# EAGLE schematic OOBDROID_V1 (EAGLE 7.2.0)
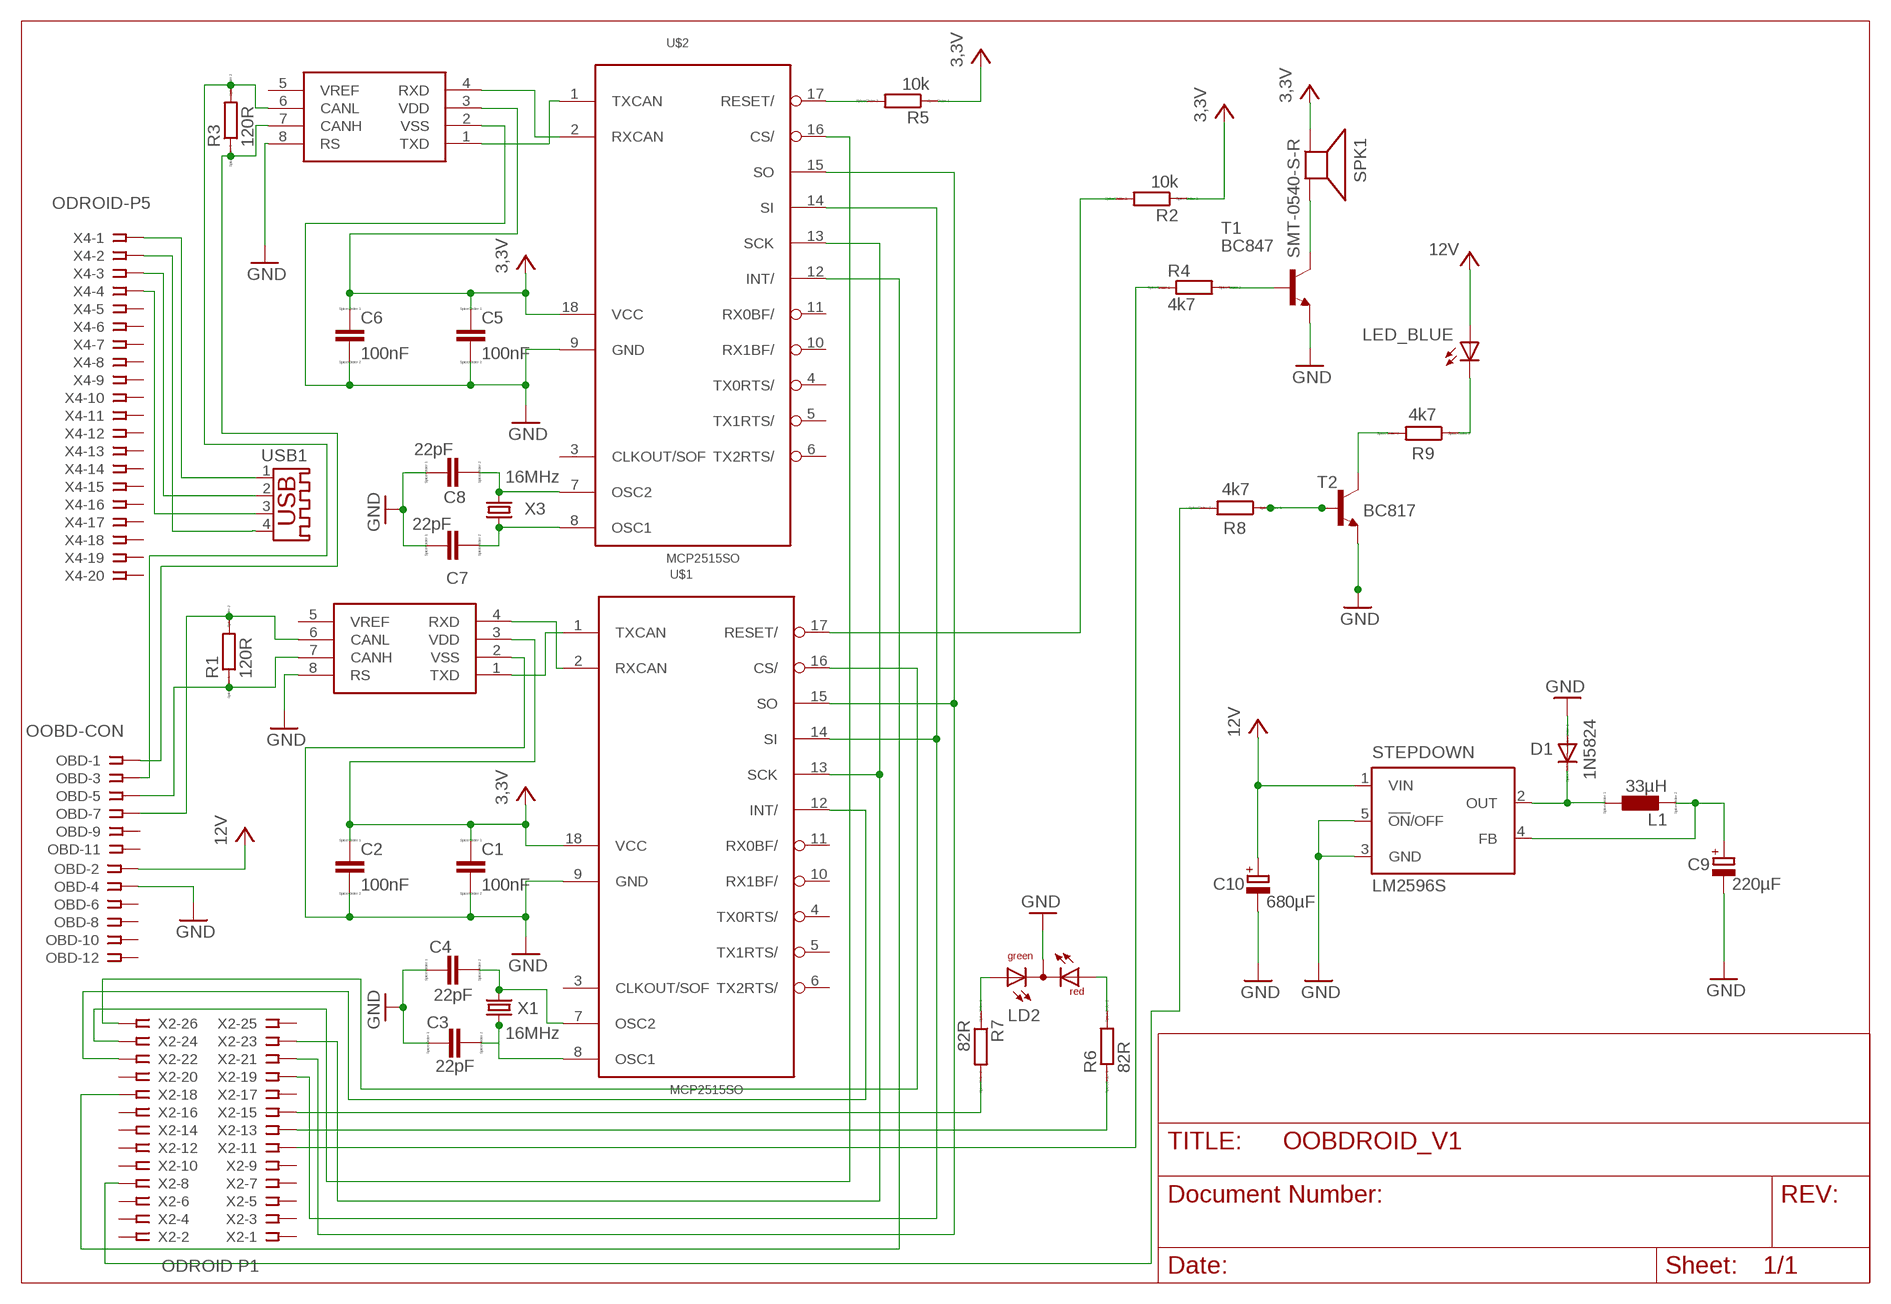
[diagram p0: schematic, sheet 1]

## Parts
C1  100nF  C  [C0805]
C2  100nF  C  [C0805]
C3  22pF  C  [C0805]
C4  22pF  C  [C0805]
C5  100nF  C  [C0805]
C6  100nF  C  [C0805]
C7  22pF  C  [C0805]
C8  22pF  C  [C0805]
C9  220µF  CPOL-EUE1.8-4  [E1,8-4]
C10  680µF  CPOL-EUE1.8-4  [E1,8-4]
D1  1N5824  DIODE-DO214AA  [DO214AA]
L1  33µH  LL4532P  [L4532P]
LD2  DUOLED-RG-C  [DUOLED-C-5MM]
LED_BLUE  LED5MM  [LED5MM]
OBD  OOBD-CON  SSW-106-02-S-D  [SSW-106-02-S-D]
R1  120R  RR0603  [R0603]
R2  10k  RR0603  [R0603]
R3  120R  RR0603  [R0603]
R4  4k7  RR0603  [R0603]
R5  10k  RR0603  [R0603]
R6  82R  RR0603  [R0603]
R7  82R  RR0603  [R0603]
R8  4k7  RR0603  [R0603]
R9  4k7  RR0603  [R0603]
SPK1  SMT-0540-S-R  [SMT-0540-S-R]
STEPDOWN  LM2596S  [TO263-5]
T1  BC847  [SOT23]
T2  BC817  BC847  [SOT23]
U1  MCP2551  [SO08]
U2  MCP2551  [SO08]
U$1  MCP2515SO  [SO18L]
U$2  MCP2515SO  [SO18L]
USB1  USB-A003  [USB-A003]
X1  16MHz  CRYSTALS-NOGND-HC49  [HC49]
X2  ODROID P1  SSW-113-02-S-D  [SSW-113-02-S-D]
X3  16MHz  CRYSTALS-NOGND-HC49  [HC49]
X4  ODROID-P5  SSW-120-02-S-S  [SSW-120-02-S-S]

## Nets
GND: C1.2 C2.2 C3.1 C4.1 C5.2 C6.2 C7.1 C8.1 C9.- C10.- D1.A LD2.C OBD.4 STEPDOWN.3(GND) STEPDOWN.5(!ON!/OFF) T1.2(E) T2.2(E) U1.2(VSS) U1.8(RS) U2.2(VSS) U2.8(RS) U$1.9(GND) U$2.9(GND)
N$1: OBD.5 R1.1 U1.7(CANH)
N$2: D1.C L1.1 STEPDOWN.2(OUT)
N$3: C8.2 U$2.7(OSC2) X3.2
N$4: C9.+ L1.2 STEPDOWN.4(FB)
N$5: C7.2 U$2.8(OSC1) X3.1
N$6: R5.2 U$2.17(RESET/)
N$7: U2.4(RXD) U$2.2(RXCAN)
N$8: U2.1(TXD) U$2.1(TXCAN)
N$9: OBD.3 R3.2 U2.6(CANL)
N$10: OBD.1 R3.1 U2.7(CANH)
N$11: C4.2 U$1.7(OSC2) X1.2
N$12: C3.2 U$1.8(OSC1) X1.1
N$13: R2.2 U$1.17(RESET/)
N$14: U1.4(RXD) U$1.2(RXCAN)
N$15: U1.1(TXD) U$1.1(TXCAN)
N$16: OBD.7 R1.2 U1.6(CANL)
N$18: LED_BLUE.K(C) R9.1
N$19: U$1.16(CS/) X2.26
N$20: SPK1.+(-) T1.3(C)
N$21: R4.2 T1.1(B)
N$22: LD2.AR R6.2
N$23: LD2.AX(AG) R7.1
N$24: R7.2 X2.15
N$25: R6.1 X2.13
N$26: USB1.1 X4.1
N$27: USB1.4 X4.2
N$28: USB1.2 X4.3
N$29: USB1.3 X4.4
N$30: R4.1 X2.11
N$31: U$1.12(INT/) X2.22
N$32: U$2.12(INT/) X2.18
N$33: U$2.16(CS/) X2.24
N$34: R9.2 T2.3(C)
N$35: R8.1 T2.1(B)
N$36: R8.2 X2.8
N$38: U$1.14(SI) U$2.14(SI) X2.19
N$43: U$1.15(SO) U$2.15(SO) X2.21
N$44: U$1.13(SCK) U$2.13(SCK) X2.23
VCC: C1.1 C2.1 C5.1 C6.1 C10.+ LED_BLUE.A OBD.2 R2.1 R5.1 SPK1.-(+) STEPDOWN.1(VIN) U1.3(VDD) U2.3(VDD) U$1.18(VCC) U$2.18(VCC) ; supply symbol labelled 3,3V, 12V
Unconnected: OBD.6 OBD.8 OBD.9 OBD.10 OBD.11 OBD.12 U1.5(VREF) U2.5(VREF) U$1.3(CLKOUT/SOF) U$1.4(TX0RTS/) U$1.5(TX1RTS/) U$1.6(TX2RTS/) U$1.10(RX1BF/) U$1.11(RX0BF/) U$2.3(CLKOUT/SOF) U$2.4(TX0RTS/) U$2.5(TX1RTS/) U$2.6(TX2RTS/) U$2.10(RX1BF/) U$2.11(RX0BF/) X2.1 X2.2 X2.3 X2.4 X2.5 X2.6 X2.7 X2.9 X2.10 X2.12 X2.14 X2.16 X2.17 X2.20 X2.25 X4.5 X4.6 X4.7 X4.8 X4.9 X4.10 X4.11 X4.12 X4.13 X4.14 X4.15 X4.16 X4.17 X4.18 X4.19 X4.20

## Library data of the parts
C1-C8 = eagle-ltspice:C: CAPACITOR, European symbol; SPICEMODEL: NONE; SPICEPREFIX: C
C9 C10 = resistor:CPOL-EU: POLARIZED CAPACITOR, European symbol
D1 = diode:DIODE-: DIODE
L1 = eagle-ltspice:L: INDUCTOR, European symbol; SPICEMODEL: NONE; SPICEPREFIX: L
LD2 = led:DUOLED-RG-C: DUO LED 2 colors (red/green), 5 mm, round, common Cathode www.ligitek.com or other producers.
LED_BLUE = adafruit:LED: LED OSRAM: - CHIPLED LG R971, LG N971, LY N971, LG Q971, LY Q971, LO R971, LY R971 LH N974, LH R974 LS Q976, LO Q976, LY Q976 LO Q996 - Hyper CHIPLED LW Q18S LB Q993, LB Q99A, LB R99A - SideLED LS A670, LO A670, LY A670, LG A670, LP A670 LB A673, LV A673, LT A673, LW A673 LH A674 LY A675 LS A676, LA A676, LO A676, LY A676, LW A676 LS A679, LY A679, LG A679 - Hyper Micro SIDELED® LS Y876, LA Y876, LO Y876, LY Y876 LT Y87S - SmartLED LW L88C, LW L88S LB L89C, LB L89S, LG L890 LS L89K, LO L89K, LY L89K LS L896, LA L896, LO L896, LY L896 - TOPLED LS T670, LO T670, LY T670, LG T670, LP T670 LSG T670, LSP T670, LSY T670, LOP T670, LYG T670 LG T671, LOG T671, LSG T671 LB T673, LV T673, LT T673, LW T673 LH T674 LS T676, LA T676, LO T676, LY T676, LB T676, LH T676, LSB T676, LW T676 LB T67C, LV T67C, LT T67C, LS T67K, LO T67K, LY T67K, LW E67C LS E67B, LA E67B, LO E67B, LY E67B, LB E67C, LV E67C, LT E67C LW T67C LS T679, LY T679, LG T679 LS T770, LO T770, LY T770, LG T770, LP T770 LB T773, LV T773, LT T773, LW T773 LH T774 LS E675, LA E675, LY E675, LS T675 LS T776, LA T776, LO T776, LY T776, LB T776 LHGB T686 LT T68C, LB T68C - Hyper Mini TOPLED® LB M676 - Mini TOPLED Santana® LG M470 LS M47K, LO M47K, LY M47K Source: http://www.osram.convergy.de/
OBD = con-samtec:SSW-106-02-S-D: THROUGH-HOLE .025" SQ POST SOCKET Source: Samtec SSW.pdf; MPN: SSW-106-02-S-D; OC_FARNELL: unknown; OC_NEWARK: 11P9414
R1-R9 = eagle-ltspice:R: RESISTOR, European symbol; SPICEMODEL: NONE; SPICEPREFIX: R
SPK1 = adafruit:SMT-0540-S-R: SMT-0549-S-R Small surface-mount magnetic buzzer
STEPDOWN = national-semiconductor:LM2596: SIMPLE SWITCHER® Power Converter 150 kHz 3A Step-Down Voltage Regulator Source: http://www.national.com/ds/LM/LM2596.pdf; MF: NATIONAL SEMICONDUCTOR; MPN: LM2596S-ADJ/NOPB; OC_FARNELL: 9494367; OC_NEWARK: 41K3842
T1 T2 = transistor:BC847: NPN TRANSISTOR
U1 U2 = SparkFun:MCP2551
U$1 U$2 = MCP2515_MT:MCP2515*: MCP2515 Standalone CAN-Controller by Microchip Eagle-Lib. by MartinThomas
USB1 = con-yamaichi:USB-A003: USB connector; OC_FARNELL: unknown; OC_NEWARK: unknown
X1 X3 = IQD-Frequency-Products:CRYSTALS-NOGND: CRYSTALS CAN NOT GROUNDED
X2 = con-samtec:SSW-113-02-S-D: THROUGH-HOLE .025" SQ POST SOCKET Source: Samtec SSW.pdf; MPN: SSW-113-02-S-D; OC_FARNELL: unknown; OC_NEWARK: 11P9530
X4 = con-samtec:SSW-120-02-S-S: THROUGH-HOLE .025" SQ POST SOCKET Source: Samtec SSW.pdf; MPN: SSW-120-02-S-S; OC_FARNELL: unknown; OC_NEWARK: 11P9641